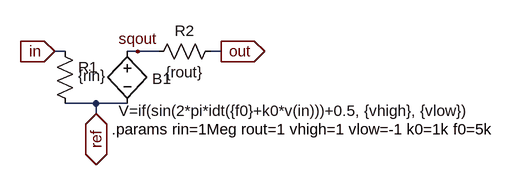
[diagram p0: schematic vco.asc]
vco.asc, the LTspice schematic file:
Version 4
SHEET 1 880 680
WIRE 16 176 0 176
WIRE 64 256 16 256
WIRE 64 272 64 256
WIRE 112 256 64 256
WIRE 128 176 112 176
WIRE 160 176 128 176
WIRE 256 176 240 176
FLAG 0 176 in
IOPIN 0 176 In
FLAG 64 272 ref
IOPIN 64 272 BiDir
FLAG 256 176 out
IOPIN 256 176 Out
FLAG 128 176 sqout
SYMBOL res 0 160 R0
WINDOW 3 36 53 Left 0
SYMATTR Value {rin}
SYMATTR InstName R1
SYMBOL bv 112 160 R0
WINDOW 0 38 58 Left 0
WINDOW 3 -13 107 Left 0
SYMATTR InstName B1
SYMATTR Value V=if(sin(2*pi*idt({f0}+k0*v(in)))+0.5, {vhigh}, {vlow})
SYMBOL res 256 160 R90
WINDOW 0 0 56 VBottom 0
WINDOW 3 32 56 VTop 0
SYMATTR InstName R2
SYMATTR Value {rout}
TEXT 88 296 Left 0 !.params rin=1Meg rout=1 vhigh=1 vlow=-1 k0=1k f0=5k

The netlist it stands for:
* vco.asc
R1 in ref {rin}
B1 sqout ref V=if(sin(2*pi*idt({f0}+k0*v(in)))+0.5, {vhigh}, {vlow})
R2 out sqout {rout}
.params rin=1Meg rout=1 vhigh=1 vlow=-1 k0=1k f0=5k
.backanno
.end